# EAGLE schematic battery_buzzer (EAGLE 6.5.0)
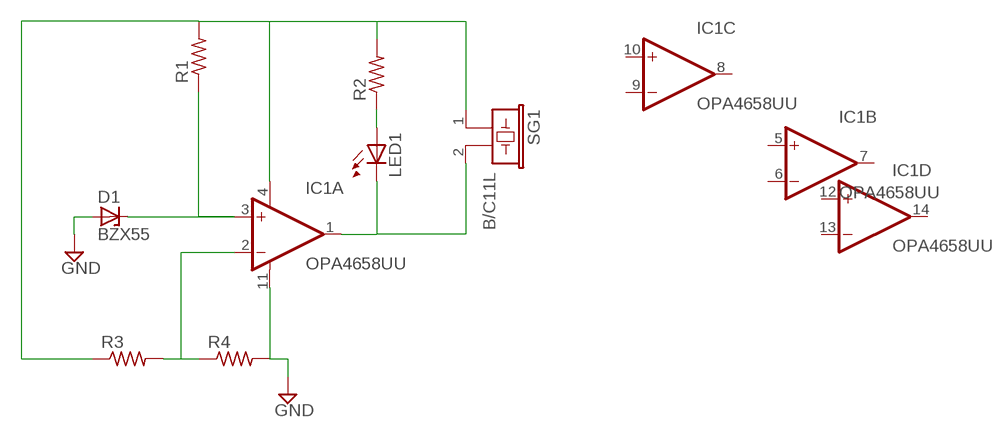
[diagram p0: schematic, sheet 1]

## Parts
D1  BZX55  [DO35Z10]
IC1  OPA4658UU  [SO14]
LED1  LED-FKIT-1206  [FKIT-LED-1206]
R1  R-US_R0603  [R0603]
R2  R-US_R0603  [R0603]
R3  R-US_R0603  [R0603]
R4  R-US_R0603  [R0603]
SG1  B/C11L  [B/C11L]

## Nets
GND: D1.A IC1.11(A:V-) R4.2
N$1: LED1.A R2.1
N$2: D1.C IC1.3(A:+IN) R1.1
N$3: IC1.4(A:V+) R1.2 R2.2 R3.1 SG1.1
N$4: IC1.2(A:-IN) R3.2 R4.1
N$6: IC1.1(A:OUT) LED1.C SG1.2
Unconnected: IC1.5(B:+IN) IC1.6(B:-IN) IC1.7(B:OUT) IC1.8(C:OUT) IC1.9(C:-IN) IC1.10(C:+IN) IC1.12(D:+IN) IC1.13(D:-IN) IC1.14(D:OUT)

## Library data of the parts
D1 = diode:BZX55: Z DIODE
IC1 = burr-brown:OPA4658U: Operational Amplifier; OC_FARNELL: unknown; OC_NEWARK: unknown
LED1 = pie:LED: LEDs Standard schematic elements and footprints for 5mm, 3mm, 1206, and 0603 sized LEDs. 5mm - Spark Fun Electronics SKU : COM-00529 (and others)
R1-R4 = pie:R-US_: RESISTOR, American symbol
SG1 = buzzer:B/C11L: BUZZER Source: Buerklin; OC_FARNELL: unknown; OC_NEWARK: unknown